# EasyEDA Pro project ProPrj_电力电子综合设计_2025-07-04.epro, schematic Schematic1
Board Name: MCU; Create Date: 2025-06-15; Page Name: P1; Project Name: 电力电子综合设计; Schematic Name: Schematic1; Update Date: 2025-06-15; Company: 嘉立创EDA; Page Size: A4; Version: V1.0
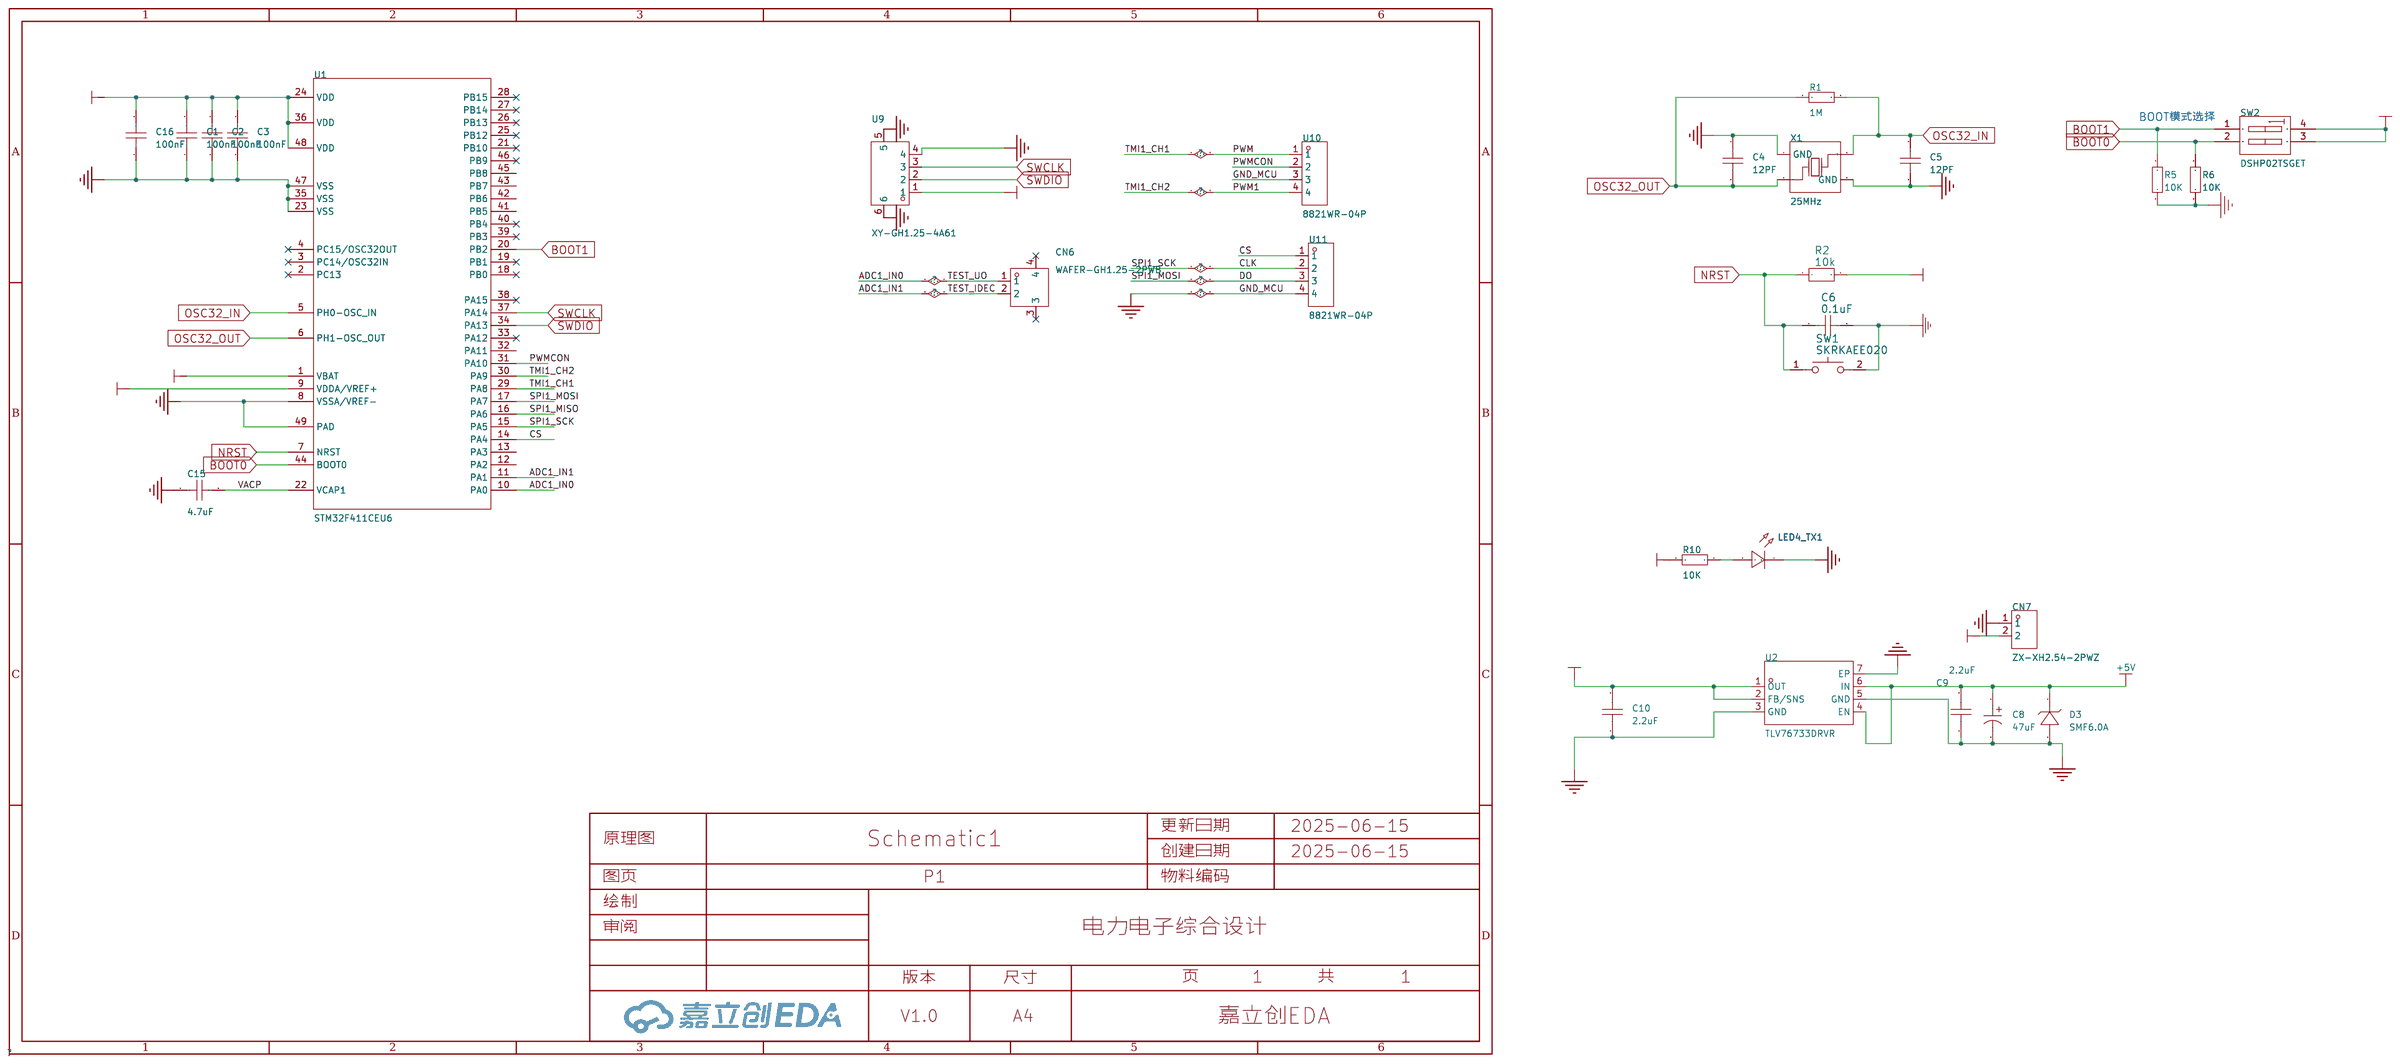
[diagram p0: schematic sheet]

## Parts
C1  100nF  [C0603]
C2  100nF  [C0603]
C3  100nF  [C0603]
C4  12PF  [C0603]
C5  12PF  [C0603]
C6  0.1uF  [C0603]
C8  47uF  [CAP-SMD_L3.2-W1.6]  (no BOM)
C9  2.2uF  [C0603]
C10  2.2uF  [C0603]
C15  4.7uF  [C0603]
C16  100nF  [C0603]
CN6  WAFER-GH1.25-2PWB  [CONN-TH_2P-P1.25_XUNPU_WAFER-GH1.25-2PWB]
CN7  ZX-XH2.54-2PWZ  [CONN-TH_2P-P2.50_ZX-XH2.54-2PWZ]
D3  SMF6.0A  [SOD-123FL_L2.7-W1.8-LS3.8-RD]
LED4_TX1  -  [LED_0603]
R1  1M  [R0603]
R2  10k  [R0603]
R5  10K  [0603]
R6  10K  [0603]
R10  10K  [R0603]
SW1  SKRKAEE020  [SW-SMD_L3.9-W3.0-P4.45]
SW2  DSHP02TSGET  [SW-SMD_4P_DSHP02TSGET]
U1  STM32F411CEU6  [UFQFPN-48_L7.0-W7.0-P0.50-BL-EP]
U2  TLV76733DRVR  [WSON-6_L2.0-W2.0-P0.65-TL-EP]
U9  XY-GH1.25-4A61  [CONN-SMD_4P-P1.25_XYECONN_XY-GH1.25-4A61]
U10  8821WR-04P  [CONN-TH_X8821WR-04SL-N0SN]
U11  8821WR-04P  [CONN-TH_X8821WR-04SL-N0SN]
X1  25MHz  [CRYSTAL-SMD_4P-L3.2-W2.5-BL]

## Library data of the parts
C1-C5 C15 C16 = CAP_0603: Supplier Footprint: 0603
C6 = 100nf
C8 = CA45-A-10V-47uF-M: 容值:47uF;精度:±20%;额定电压:10V;等效串联电阻:4Ω@100kHz;; LCSC Part Name: 47uF ±20% 10V; Supplier Part: C688949; Manufacturer: CEC(振华新云); Supplier Footprint: CASE-A-3216; JLCPCB Part Class: 扩展库; Datasheet: https://atta.szlcsc.com/upload/public/pdf/source/20200701/C688947_CFA6E56082A981E438B337581FD21AD9.pdf; Supplier: LCSC; Tolerance: ±20%; Rated Voltage: 10V; Equivalent Series Resistance(ESR): 4Ω@100kHz; Operating Temperature: -55℃~+125℃
C9 C10 = CL10A225KB8NNNC: 容值:2.2uF;精度:±10%;额定电压:50V;材质(温度系数):X5R;; LCSC Part Name: 2.2uF ±10% 50V; Supplier Part: C913904; Manufacturer: SAMSUNG(三星); Supplier Footprint: 0603; JLCPCB Part Class: 扩展库; Datasheet: https://atta.szlcsc.com/upload/public/pdf/source/20160218/1457707763339.pdf; Supplier: LCSC; Tolerance: ±10%; Voltage Rated: 50V; Temperature Coefficient: X5R
CN6 = WAFER-GH1.25-2PWB: 插针结构:1x2P;间距:1.25mm;安装方式:卧贴;参考系列:GH;总PIN数:2P;排数:1;每排PIN数:2;行距:-;额定电流:1A;触头材质:黄铜;触头镀层:-;工作温度范围:-25℃~+85℃;; LCSC Part Name: 1x2P 间距:1.25mm 卧贴 系列:GH; Supplier Part: C3029377; Manufacturer: XUNPU(讯普); Supplier Footprint: SMD,P=1.25mm,卧贴; JLCPCB Part Class: 扩展库; Datasheet: https://atta.szlcsc.com/upload/public/pdf/source/20220527/CB8773BFB0913C3B8ABD62CB38BA101A.pdf; Supplier: LCSC; Pins Structure: 1x2P; Pitch: 1.25mm; Mounting Type: 卧贴; Reference Series: GH; Number of Pins: 2P; Number of Rows: 1; Number of PINs Per Row: 2; Current Rating: 1A; Contact Material: 黄铜; Operating Temperature: -25℃~+85℃; Voltage Rating: 125V; Plastic Material: LCP; Supplementary Features: 辅助焊脚; Color: 米色; Z-Height of the Board: 4.35mm; X-Length of Bottom Edge on Board (Spacing Line): 5.75mm; Y-Width of Bottom Edge on Board: 5mm
CN7 = ZX-XH2.54-2PWZ: 插针结构:1x2P;间距:2.5mm;安装方式:弯插;参考系列:XH;总PIN数:2P;排数:1;每排PIN数:2;行距:-;额定电流:3A;触头材质:黄铜;触头镀层:锡;工作温度范围:-25℃~+85℃;; LCSC Part Name: 1x2P 间距:2.5mm 弯插 系列:XH; Supplier Part: C7429641; Manufacturer: Megastar(兆星); Supplier Footprint: 弯插,P=2.5mm; Datasheet: https://atta.szlcsc.com/upload/public/pdf/source/20230619/56AE8F2E01CDFEAA97FC89B5ED558AB5.pdf; Supplier: LCSC; Pins Structure: 1x2P; Pitch: 2.5mm; Mounting Type: 弯插; Reference Series: XH; Number of Pins: 2P; Number of Rows: 1; Number of PINs Per Row: 2; Rated Current: 3A; Contact Material: 黄铜; Contact Plating: 锡; Operating Temperature: -25℃~+85℃; Rated Voltage (Max): 250V; Plastic Material: PA66; Flame Retardant Rating: UL94V-0; Color: 白色; Z-Height of the Board: 5.9mm; X-Length of Bottom Edge on Board (Spacing Line): 7.5mm; Y-Width of Bottom Edge on Board: 7.32mm
D3 = SMF6.0A_C19077499: 极性:单向;反向截止电压(Vrwm):6V;最大钳位电压:10.3V;峰值脉冲电流(Ipp):19.4A;峰值脉冲功率(Ppp):200W;击穿电压:6.67V;; Supplier Part: C19077499; Manufacturer: 宏迦橙; Supplier Footprint: SOD-123FL; JLCPCB Part Class: 扩展库; Datasheet: https://atta.szlcsc.com/upload/public/pdf/source/20241029/BBF9A11676F655A5C9D4546A153AB943.pdf; Supplier: LCSC; polarity: 单向; Reverse Stand-Off Voltage (Vrwm): 6V; Maximum Clamping Voltage: 10.3V; Peak Pulse Current (Ipp): 19.4A; Peak Pulse Power Dissipation (Ppp): 200W; Breakdown Voltage: 6.67V; Reverse Leakage Current (Ir): 400uA; Number of Lines: 单路; Operating Temperature: -55℃~+155℃; Type: TVS
LED4_TX1 = LED_0603-G: Supplier Footprint: 0603
R1 R10 = Res_0603: Supplier Footprint: 0603
R2 = 10k
R5 R6 = 10K: 贴片电阻; BOM名称: 贴片电阻; 学习资源: www.ooocke.com; 版权归属: 源创客; Design Item ID: R; Library Name: 3.1   - 电阻-电容-电感
SW1 = SKRKAEE020: Supplier: LCSC; Manufacturer: ALPSALPINE(阿尔卑斯阿尔派); Supplier Part: C115357; JLCPCB Part Class: ExtendedPart
SW2 = DSHP02TSGET: 类型:平拨,凹槽式;电路结构:单刀单掷;开关位数:2位;使用寿命:-;颜色:黑色;; LCSC Part Name: 2位 1.27间距; Supplier Part: C40735; Manufacturer: YE; Supplier Footprint: SMD-4P,4.1x5.4mm; JLCPCB Part Class: 扩展库; Datasheet: https://atta.szlcsc.com/upload/public/pdf/source/20230904/D79341BE29271F006F9CB44DF18F7895.pdf; Supplier: LCSC; Type: 平拨,凹槽式; Circuit: 单刀单掷; Number of Positions: 2位; Lead Pitch: 1.27mm; Color: 黑色
U1 = STM32F411CEU6: CPU内核:CM4;程序存储容量:512KB;RAM总容量:128KB;GPIO端口数量:36;工作电压范围:1.7V~3.6V;CPU最大主频:100MHz;程序存储器类型:FLASH;; Supplier Part: C60420; Manufacturer: ST(意法半导体); Supplier Footprint: UFQFPN-48(7x7); JLCPCB Part Class: 扩展库; Datasheet: https://atta.szlcsc.com/upload/public/pdf/source/20151026/1457707507170.pdf; Supplier: LCSC; CPU Core: CM4; Program Storage Size: 512KB; RAM Size: 128KB; GPIO Ports Number: 36; Operating Voltage Range: 1.7V~3.6V; CPU Maximum Speed: 100MHz; Program Memory Type: FLASH; Operating Temperature Range: -40℃~+85℃; ADC (Bit): 12bit; Universal Serial Bus: 有; Peripheral/Function: DMA；PWM; Watchdog: 有; Infrared Data Association: 有; Low-Voltage Detect: 有; Secure Digital Input and Output: 有; Direct Memory Access: 有; Internal Oscillator: 有
U2 = TLV76733DRVR: 输出类型:固定;最大输入电压:16V;输出电压:3.3V;输出电流:1A;电源纹波抑制比(PSRR):70dB@(120Hz);输出极性:正极;; LCSC Part Name: 具有可调节输出和固定输出的 1A、16V 正电压低压降 (LDO) 线性稳压器; Supplier Part: C2848334; Manufacturer: TI(德州仪器); Supplier Footprint: WSON-6(2x2); JLCPCB Part Class: 扩展库; Datasheet: https://www.ti.com/cn/lit/gpn/tlv767; Supplier: LCSC; Output Type: 固定; Maximum Input Voltage: 16V; Output Voltage: 3.3V; Output Current: 1A; Power Supply Rejection Ratio (PSRR): 70dB@(120Hz); Dropout Voltage: 1.4V@(1A); standby current: 80uA; Feature: 防静电保护；软启动；浪涌保护；低ESR；热保护(TSD)；欠压闭锁；过流保护(OCP)；带使能；防倒灌; Operating Temperature: -40℃~+125℃@(Tj); Output Polarity: 正极; Number of Outputs: 1
U9 = XY-GH1.25-4A61: 插针结构:1x4P;间距:1.25mm;安装方式:卧贴;总PIN数:4P;排数:1;每排PIN数:4;行距:2mm;; LCSC Part Name: 间距:1.25mm 1x4P 卧贴 带扣; Supplier Part: C19272061; Manufacturer: XYECONN(辛译); Supplier Footprint: SMD,P=1.25mm,卧贴; JLCPCB Part Class: 扩展库; Datasheet: https://atta.szlcsc.com/upload/public/pdf/source/20231128/F7FA5B8B29E8FE9C6005F4DAEBFEB22D.pdf; Supplier: LCSC; Pins Structure: 1x4P; Pitch: 1.25mm; Mounting Style: 卧贴; Number of Pins: 4P; Number of Rows: 1; Number of PINs Per Row: 4; Row Spacing: 2mm
U10 U11 = 8821WR-04P: 插针结构:1x4P;间距:2.5mm;安装方式:弯插;参考系列:XH;; LCSC Part Name: 1x4P 间距:2.5mm 弯插 系列:XH; Supplier Part: C5447997; Manufacturer: HanElectricity(瀚源); Supplier Footprint: 插件,P=2.5mm; JLCPCB Part Class: 扩展库; Datasheet: https://atta.szlcsc.com/upload/public/pdf/source/20230630/054631F6D5B49E4E679276F4863EADB6.pdf; Supplier: LCSC; Pins Structure: 1x4P; Pitch: 2.5mm; Mounting Type: 弯插; Reference Series: XH
X1 = X1E0000210139: 晶振类型:贴片晶振;频率:25MHz;常温频差:±10ppm;外接负载电容:12pF;; LCSC Part Name: 25MHz ±10ppm 12pF; Supplier Part: C91750; Manufacturer: EPSON(爱普生); Supplier Footprint: SMD3225-4P; JLCPCB Part Class: 扩展库; Datasheet: https://atta.szlcsc.com/upload/public/pdf/source/20180822/C255942_D265278E6344B989D9430C320788A855.pdf; Supplier: LCSC; Crystal Type: 贴片晶振; Normal temperature Frequency Tolerance: ±10ppm; External load capacitor: 12pF; Equivalent Series Resistance (ESR): 40Ω; Operating Temperature: -40℃~+85℃

## Nets
3V3: C1.2 C2.1 C3.1 C10.2 C16.2 R2.2 R10.2 SW2.3(B2) SW2.4(B1) U1.1(VBAT) U1.9(VDDA/VREF+) U1.24(VDD) U1.36(VDD) U1.48(VDD) U2.1(OUT) U2.2(FB/SNS) U9.1
+5V: C8.1 C9.2 CN7.2 D3.1(K) U2.4(EN) U2.6(IN)
GND: C1.1 C2.2 C3.2 C4.1 C5.1 C6.2 C8.2 C9.1 C10.1 C15.1 C16.1 CN7.1 D3.2(A) LED4_TX1.1(C) R5.2 R6.2 SW1.2 U1.8(VSSA/VREF-) U1.23(VSS) U1.35(VSS) U1.47(VSS) U1.49(PAD) U2.3(GND) U2.5(GND) U2.7(EP) U9.4 U9.5 U9.6 U10.3 U11.4 X1.2(GND) X1.4(GND)
ADC1_IN0: CN6.1 U1.10(PA0)
ADC1_IN1: CN6.2 U1.11(PA1)
BOOT0: R6.1 SW2.2(A2) U1.44(BOOT0)
BOOT1: R5.1 SW2.1(A1) U1.20(PB2)
CLK: U1.15(PA5) U11.2
CS: U1.14(PA4) U11.1
DO: U1.17(PA7) U11.3
NRST: C6.1 R2.1 SW1.1 U1.7(NRST)
OSC32_IN: C5.2 R1.2 U1.5(PH0-OSC_IN) X1.3(OSC2)
OSC32_OUT: C4.2 R1.1 U1.6(PH1-OSC_OUT) X1.1(OSC1)
PWM: U1.29(PA8) U10.1
PWM1: U1.30(PA9) U10.4
PWMCON: U1.31(PA10) U10.2
SPI1_MISO: U1.16(PA6)
SWCLK: U1.37(PA14) U9.3
SWDIO: U1.34(PA13) U9.2
VACP: C15.2 U1.22(VCAP1)
$1N1231: LED4_TX1.2(A) R10.1

Not connected (* = marked no-connect by the designer): CN6 3* 4*; U1 2(PC13)* 3(PC14/OSC32IN)* 4(PC15/OSC32OUT)* 12(PA2) 13(PA3) 18(PB0)* 19(PB1)* 21(PB10)* 25(PB12)* 26(PB13)* 27(PB14)* 28(PB15)* 32(PA11) 33(PA12)* 38(PA15)* 39(PB3)* 40(PB4)* 41(PB5) 42(PB6) 43(PB7) 45(PB8) 46(PB9)*

## Notes on the sheet
- BOOT模式选择
